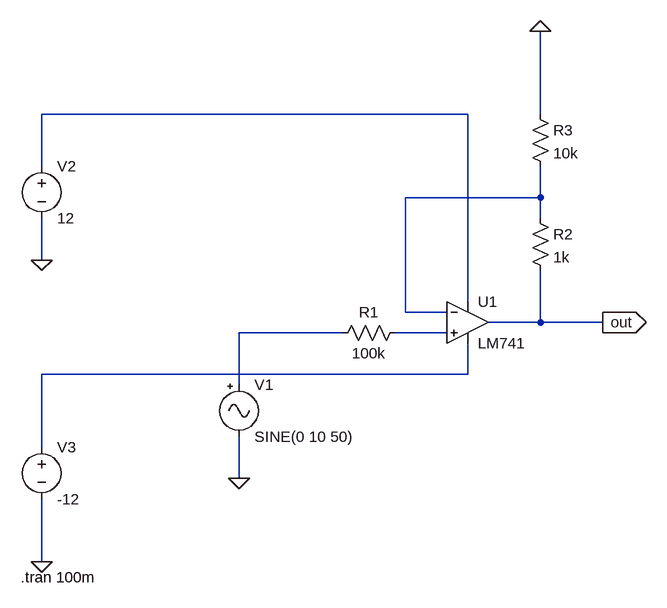
[diagram p0: schematic lm741_deneme.asc]
lm741_deneme.asc, the LTspice schematic file:
Version 4
SHEET 1 880 680
WIRE 256 -144 -400 -144
WIRE 368 -144 368 -272
WIRE -400 -64 -400 -144
WIRE 368 -16 368 -64
WIRE 368 -16 160 -16
WIRE 368 16 368 -16
WIRE -400 80 -400 16
WIRE 256 144 256 -144
WIRE 160 160 160 -16
WIRE 224 160 160 160
WIRE 368 176 368 96
WIRE 368 176 288 176
WIRE 464 176 368 176
WIRE 64 192 -96 192
WIRE 224 192 144 192
WIRE 256 256 256 208
WIRE 256 256 -400 256
WIRE -96 272 -96 192
WIRE -400 368 -400 256
WIRE -96 416 -96 352
WIRE -400 544 -400 448
FLAG 368 -272 0
FLAG -96 416 0
FLAG -400 80 0
FLAG -400 544 0
FLAG 464 176 out
IOPIN 464 176 Out
SYMBOL OpAmps\\LM741 256 112 R0
SYMATTR InstName U1
SYMBOL Misc\\signal -96 256 R0
WINDOW 123 0 0 Left 0
WINDOW 39 0 0 Left 0
SYMATTR InstName V1
SYMATTR Value SINE(0 10 50)
SYMBOL res 160 176 R90
WINDOW 0 0 56 VBottom 2
WINDOW 3 32 56 VTop 2
SYMATTR InstName R1
SYMATTR Value 100k
SYMBOL res 352 0 R0
SYMATTR InstName R2
SYMATTR Value 1k
SYMBOL res 352 -160 R0
SYMATTR InstName R3
SYMATTR Value 10k
SYMBOL voltage -400 -80 R0
WINDOW 123 0 0 Left 0
WINDOW 39 0 0 Left 0
SYMATTR InstName V2
SYMATTR Value 12
SYMBOL voltage -400 352 R0
WINDOW 123 0 0 Left 0
WINDOW 39 0 0 Left 0
SYMATTR InstName V3
SYMATTR Value -12
TEXT -432 568 Left 2 !.tran 100m

The netlist it stands for:
* lm741_deneme.asc
XU1 N004 N002 N001 N005 out LM741  ; pins In+ In- V+ V- OUT
V1 N003 0 SINE(0 10 50)
R1 N004 N003 100k
R2 N002 out 1k
R3 0 N002 10k
V2 N001 0 12
V3 N005 0 -12
.tran 100m
.lib LM741.lib
.backanno
.end